# EAGLE design untitled (EAGLE 9.6.2)
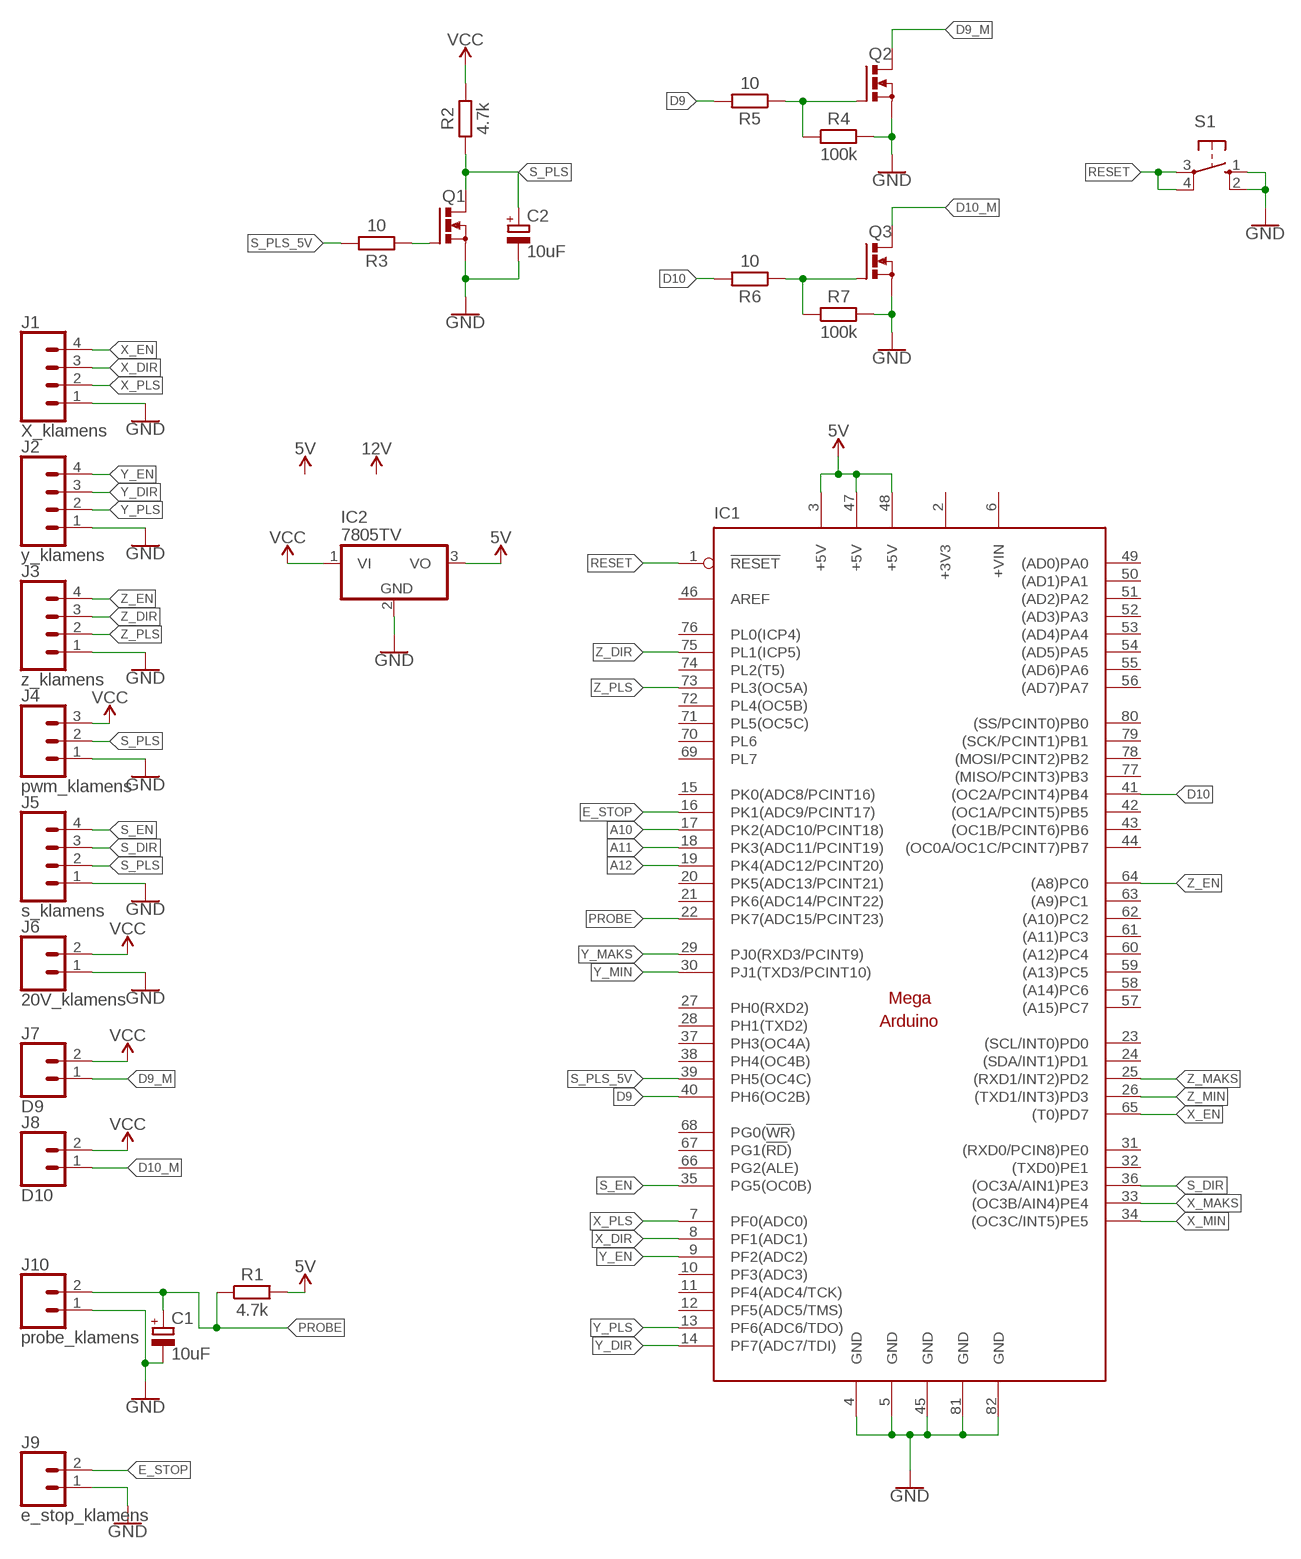
[diagram p0: schematic, sheet 1]

## Parts
C1  10uF  C-POL_RADIAL-11MM-DIA  [CAPPRD508W65D1000H1100B]
C2  10uF  C-POL_RADIAL-11MM-DIA  [CAPPRD508W65D1000H1100B]
IC1  MEGAARDUINO_1  [MEGA_ARDUINO]
IC2  7805TV  [TO220V]
J1  X_klamens  CONN_04SCREW_LOCK  [SCREWTERMINAL-3.5MM-4_LOCK]
J2  y_klamens  CONN_04SCREW_LOCK  [SCREWTERMINAL-3.5MM-4_LOCK]
J3  z_klamens  CONN_04SCREW_LOCK  [SCREWTERMINAL-3.5MM-4_LOCK]
J4  pwm_klamens  CONN_03SCREW  [SCREWTERMINAL-3.5MM-3]
J5  s_klamens  CONN_04SCREW_LOCK  [SCREWTERMINAL-3.5MM-4_LOCK]
J6  20V_klamens  CONN_023.5MM_LOCK  [SCREWTERMINAL-3.5MM-2_LOCK]
J7  D9  CONN_023.5MM_LOCK  [SCREWTERMINAL-3.5MM-2_LOCK]
J8  D10  CONN_023.5MM_LOCK  [SCREWTERMINAL-3.5MM-2_LOCK]
J9  e_stop_klamens  CONN_023.5MM_LOCK  [SCREWTERMINAL-3.5MM-2_LOCK]
J10  probe_klamens  CONN_023.5MM_LOCK  [SCREWTERMINAL-3.5MM-2_LOCK]
Q1  PMOSFET_NTO220BV  [TO220BV]
Q2  PMOSFET_NTO220BV  [TO220BV]
Q3  PMOSFET_NTO220BV  [TO220BV]
R1  4.7k  R_AXIAL-11.7MM-PITCH  [RESAD1176W63L850D250B]
R2  4.7k  R_AXIAL-11.7MM-PITCH  [RESAD1176W63L850D250B]
R3  10  R_AXIAL-11.7MM-PITCH  [RESAD1176W63L850D250B]
R4  100k  R_AXIAL-11.7MM-PITCH  [RESAD1176W63L850D250B]
R5  10  R_AXIAL-11.7MM-PITCH  [RESAD1176W63L850D250B]
R6  10  R_AXIAL-11.7MM-PITCH  [RESAD1176W63L850D250B]
R7  100k  R_AXIAL-11.7MM-PITCH  [RESAD1176W63L850D250B]
S1  10-XX  [B3F-10XX]

## Nets
5V: IC1.3(+5V) IC1.47(+5V) IC1.48(+5V) IC2.3(VO) R1.2
A10: IC1.17(PK2(ADC10/PCINT18))
A11: IC1.18(PK3(ADC11/PCINT19))
A12: IC1.19(PK4(ADC12/PCINT20))
D9: IC1.40(PH6(OC2B)) R5.2
D9_M: J7.1 Q2.D
D10: IC1.41((OC2A/PCINT4)PB4) R6.2
D10_M: J8.1 Q3.D
E_STOP: IC1.16(PK1(ADC9/PCINT17)) J9.2
GND: C1.2(-) C2.2(-) IC1.4(GND) IC1.5(GND) IC1.45(GND) IC1.81(GND) IC1.82(GND) IC2.2(GND) J1.1 J2.1 J3.1 J4.1 J5.1 J6.1 J9.1 J10.1 Q1.S Q2.S Q3.S R4.2 R7.2 S1.1(S) S1.2(S1)
N$1: Q2.G R4.1 R5.1
N$2: Q1.G R3.1
N$3: Q3.G R6.1 R7.1
PROBE: C1.1(+) IC1.22(PK7(ADC15/PCINT23)) J10.2 R1.1
RESET: IC1.1(!RESET) S1.3(P) S1.4(P1)
S_DIR: IC1.36((OC3A/AIN1)PE3) J5.3
S_EN: IC1.35(PG5(OC0B)) J5.4
S_PLS: C2.1(+) J4.2 J5.2 Q1.D R2.1
S_PLS_5V: IC1.39(PH5(OC4C)) R3.2
VCC: IC2.1(VI) J4.3 J6.2 J7.2 J8.2 R2.2
X_DIR: IC1.8(PF1(ADC1)) J1.3
X_EN: IC1.65((T0)PD7) J1.4
X_MAKS: IC1.33((OC3B/AIN4)PE4)
X_MIN: IC1.34((OC3C/INT5)PE5)
X_PLS: IC1.7(PF0(ADC0)) J1.2
Y_DIR: IC1.14(PF7(ADC7/TDI)) J2.3
Y_EN: IC1.9(PF2(ADC2)) J2.4
Y_MAKS: IC1.29(PJ0(RXD3/PCINT9))
Y_MIN: IC1.30(PJ1(TXD3/PCINT10))
Y_PLS: IC1.13(PF6(ADC6/TDO)) J2.2
Z_DIR: IC1.75(PL1(ICP5)) J3.3
Z_EN: IC1.64((A8)PC0) J3.4
Z_MAKS: IC1.25((RXD1/INT2)PD2)
Z_MIN: IC1.26((TXD1/INT3)PD3)
Z_PLS: IC1.73(PL3(OC5A)) J3.2
Unconnected: IC1.10(PF3(ADC3)) IC1.11(PF4(ADC4/TCK)) IC1.12(PF5(ADC5/TMS)) IC1.15(PK0(ADC8/PCINT16)) IC1.20(PK5(ADC13/PCINT21)) IC1.21(PK6(ADC14/PCINT22)) IC1.23((SCL/INT0)PD0) IC1.24((SDA/INT1)PD1) IC1.27(PH0(RXD2)) IC1.28(PH1(TXD2)) IC1.31((RXD0/PCIN8)PE0) IC1.32((TXD0)PE1) IC1.37(PH3(OC4A)) IC1.38(PH4(OC4B)) IC1.42((OC1A/PCINT5)PB5) IC1.43((OC1B/PCINT6)PB6) IC1.44((OC0A/OC1C/PCINT7)PB7) IC1.46(AREF) IC1.49((AD0)PA0) IC1.50((AD1)PA1) IC1.51((AD2)PA2) IC1.52((AD3)PA3) IC1.53((AD4)PA4) IC1.54((AD5)PA5) IC1.55((AD6)PA6) IC1.56((AD7)PA7) IC1.57((A15)PC7) IC1.58((A14)PC6) IC1.59((A13)PC5) IC1.60((A12)PC4) IC1.61((A11)PC3) IC1.62((A10)PC2) IC1.63((A9)PC1) IC1.66(PG2(ALE)) IC1.67(PG1(!RD!)) IC1.68(PG0(!WR!)) IC1.69(PL7) IC1.70(PL6) IC1.71(PL5(OC5C)) IC1.72(PL4(OC5B)) IC1.74(PL2(T5)) IC1.76(PL0(ICP4)) IC1.77((MISO/PCINT3)PB3) IC1.78((MOSI/PCINT2)PB2) IC1.79((SCK/PCINT1)PB1) IC1.80((SS/PCINT0)PB0)

## Power pins joined to a net without a drawn wire
+3V3: IC1.2(+3V3)
+VIN: IC1.6(+VIN)

## Library data of the parts
C1 C2 = Capacitor:C-POL: Capacitor Polarised - Generic; CATEGORY: Capacitor
IC1 = arduino:MEGAARDUINO_1: The Arduino Mega is a microcontroller board based on the ATmega1280. - 54 digital input/output pins (of which 14 can be used as PWM outputs) - 16 analog inputs - 4 UARTs (hardware serial ports) - 16 MHz crystal oscillator - USB connection - power jack - ICSP header - reset button It contains everything needed to support the microcontroller; simply connect it to a computer with a USB cable or power it with a AC-to-DC adapter or battery to get started. The Mega is compatible with most shields designed for the Arduino Duemilanove or Diecimila. http://arduino.cc/en/Main/ArduinoBoardMega
IC2 = linear:78*: Positive VOLTAGE REGULATOR Source: http://cache.national.com/ds/LM/LM78L05.pdf http://www.fairchildsemi.com/ds/LM/LM7805.pdf
J1-J3 J5 = SparkFun-Connectors:CONN_04: Multi connection point. Often used as Generic Header-pin footprint for 0.1 inch spaced/style header connections On any of the 0.1 inch spaced packages, you can populate with these: Break Away Headers - Straight <https://www.sparkfun.com/products/116> (PRT-00116) Break Away Male Headers - Right Angle <https://www.sparkfun.com/products/553> (PRT-00553) Female Headers <https://www.sparkfun.com/products/115> (PRT-00115) Break Away Headers - Machine Pin <https://www.sparkfun.com/products/117> (PRT-00117) Break Away Female Headers - Swiss Machine Pin <https://www.sparkfun.com/products/743> (PRT-00743) For SCREWTERMINALS and SPRING TERMINALS visit here: Screw Terimnals on SparkFun.com <https://www.sparkfun.com/search/results?term=Screw+Terminals> (5mm/3.5mm/2.54mm spacing) This device is also useful as a general connection point to wire up your design to another part of your project. Our various solder wires solder well into these plated through hole pads. Hook-Up Wire - Assortment (Stranded, 22 AWG) <https://www.sparkfun.com/products/11375> (PRT-11375) Hook-Up Wire - Assortment (Solid Core, 22 AWG) <https://www.sparkfun.com/products/11367> (PRT-11367) View the entire wire category on our website here <https://www.sparkfun.com/categories/141> Special notes: Molex polarized connector foot print use with SKU : PRT-08231 with associated crimp pins and housings. 1MM SMD Version SKU: PRT-10208
J4 = SparkFun-Connectors:CONN_03: Multi connection point. Often used as Generic Header-pin footprint for 0.1 inch spaced/style header connections On any of the 0.1 inch spaced packages, you can populate with these: Break Away Headers - Straight <https://www.sparkfun.com/products/116> (PRT-00116) Break Away Male Headers - Right Angle <https://www.sparkfun.com/products/553> (PRT-00553) Female Headers <https://www.sparkfun.com/products/115> (PRT-00115) Break Away Headers - Machine Pin <https://www.sparkfun.com/products/117> (PRT-00117) Break Away Female Headers - Swiss Machine Pin <https://www.sparkfun.com/products/743> (PRT-00743) Stackable Header - 3 Pin (Female, 0.1") <https://www.sparkfun.com/products/13875> (PRT-13875) For SCREWTERMINALS and SPRING TERMINALS visit here: Screw Terimnals on SparkFun.com <https://www.sparkfun.com/search/results?term=Screw+Terminals> (5mm/3.5mm/2.54mm spacing) This device is also useful as a general connection point to wire up your design to another part of your project. Our various solder wires solder well into these plated through hole pads. Hook-Up Wire - Assortment (Stranded, 22 AWG) <https://www.sparkfun.com/products/11375> (PRT-11375) Hook-Up Wire - Assortment (Solid Core, 22 AWG) <https://www.sparkfun.com/products/11367> (PRT-11367) View the entire wire category on our website here <https://www.sparkfun.com/categories/141> Special notes: Molex polarized connector foot print use with SKU : PRT-08232 with associated crimp pins and housings.; PROD_ID: CONN-08288; SF_ID: PRT-08235
J6-J10 = SparkFun-Connectors:CONN_02: Multi connection point. Often used as Generic Header-pin footprint for 0.1 inch spaced/style header connections On any of the 0.1 inch spaced packages, you can populate with these: Break Away Headers - Straight <https://www.sparkfun.com/products/116> (PRT-00116) Break Away Male Headers - Right Angle <https://www.sparkfun.com/products/553> (PRT-00553) Female Headers <https://www.sparkfun.com/products/115> (PRT-00115) Break Away Headers - Machine Pin <https://www.sparkfun.com/products/117> (PRT-00117) Break Away Female Headers - Swiss Machine Pin <https://www.sparkfun.com/products/743> (PRT-00743) For SCREWTERMINALS and SPRING TERMINALS visit here: Screw Terimnals on SparkFun.com <https://www.sparkfun.com/search/results?term=Screw+Terminals> (5mm/3.5mm/2.54mm spacing) This device is also useful as a general connection point to wire up your design to another part of your project. Our various solder wires solder well into these plated through hole pads. Hook-Up Wire - Assortment (Stranded, 22 AWG) <https://www.sparkfun.com/products/11375> (PRT-11375) Hook-Up Wire - Assortment (Solid Core, 22 AWG) <https://www.sparkfun.com/products/11367> (PRT-11367) View the entire wire category on our website here <https://www.sparkfun.com/categories/141> Special notes: Molex polarized connector foot print use with: PRT-08233 with associated crimp pins and housings. 2.54_SCREWTERM for use with PRT-10571. 3.5mm Screw Terminal footprints for PRT-08084 5mm Screw Terminal footprints for use with PRT-08432; PROD_ID: CONN-08399
Q1-Q3 = transistor-power:PMOSFET_N: Power MOSFET N-Channel
R1-R7 = Resistor:R: Resistor Fixed - Generic; CATEGORY: Resistor; SUB-CATEGORY: Fixed
S1 = switch-omron:10-XX: OMRON SWITCH; MPN: B3F-1000; OC_FARNELL: 176432; OC_NEWARK: 36M3542

## Board
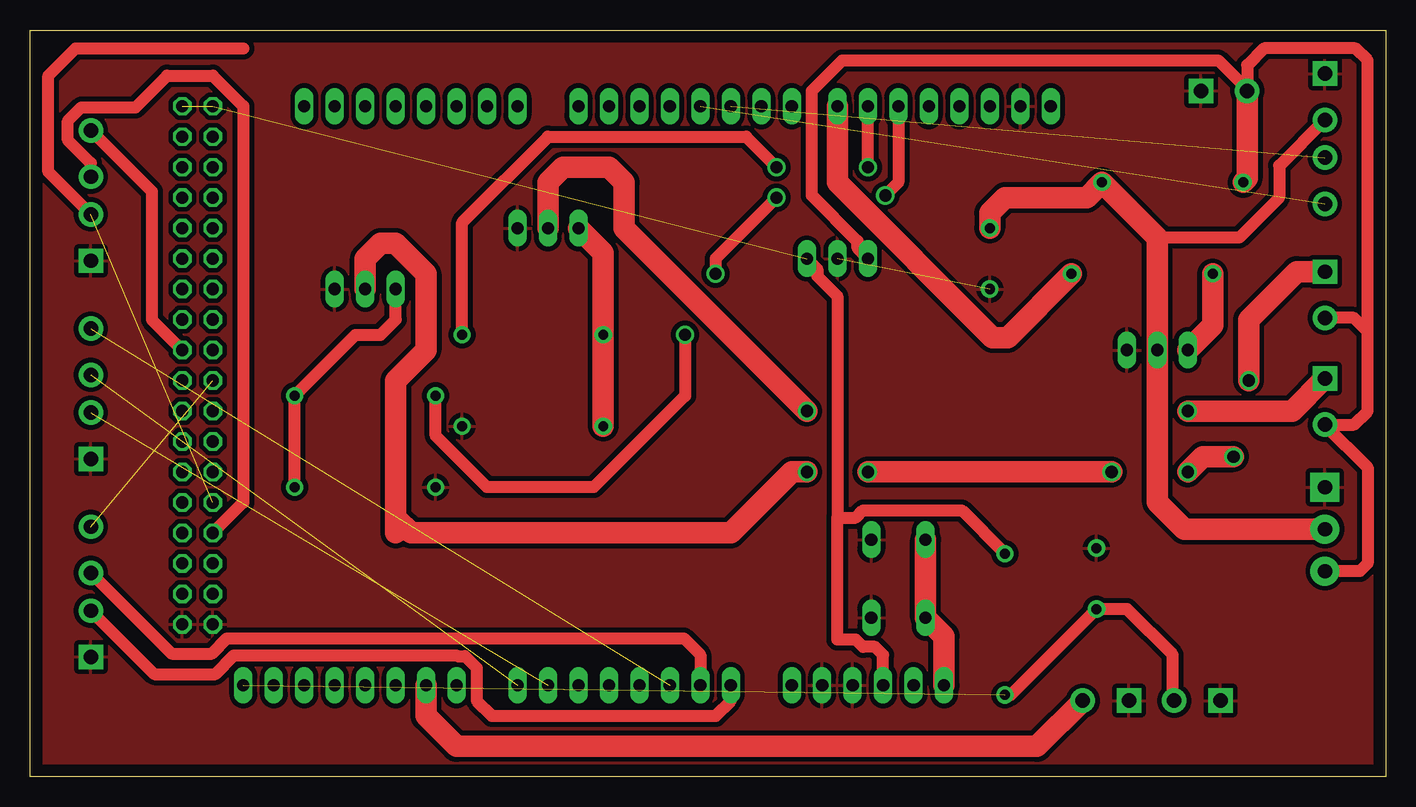
[diagram p1: board, top side]
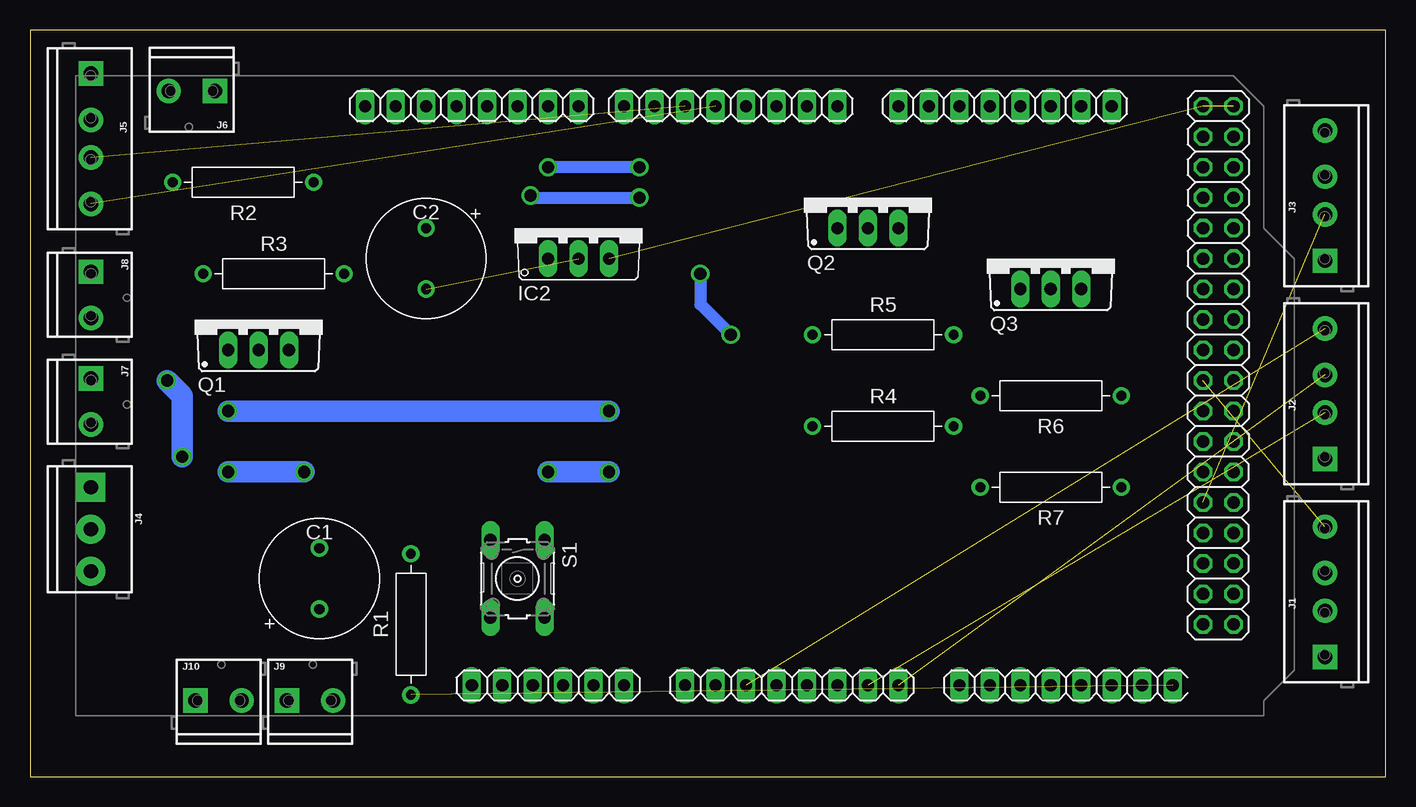
[diagram p2: board, bottom side, seen from below]

Size 113.03 x 62.23 mm. Coordinates in mm from the lower left corner, seen from the top.
Outline: 113.03,0 0.02,0 0,62.23 113.03,62.23 113.03,0
Copper layers (1*16): Top 0.035mm / dielectric 1.5mm / Bottom 0.035mm
Design rules "cnc_0.4_eagle_ayarlar": minimum track width 6mil, minimum drill 0.35mm, track to track 0.4mm, track to pad 0.4mm, pad to pad 0.4mm, via to via 0.4mm, smd to smd 0.4mm, copper to edge 40mil, drill to drill 0.4mm, minimum pad ring 10mil, minimum via ring 8mil, stop-mask expansion 4mil, vias tented up to drill 0mil, thermal gap 0.4mm

### Footprints (pad centres in the part's own frame; a part is rotated, then mirrored left to right if it is on the bottom)
CAPPRD508W65D1000H1100B = drill 0.85 pad 1.45: 1 -2.54,0; 2 2.54,0
MEGA_ARDUINO = drill 1.016 long: 1 33.02,2.54; 2 35.56,2.54; 3 38.1,2.54; 4 40.64,2.54; 5 43.18,2.54; 6 45.72,2.54; 7 50.8,2.54; 8 53.34,2.54; 9 55.88,2.54; 10 58.42,2.54; 11 60.96,2.54; 12 63.5,2.54; 13 66.04,2.54; 14 68.58,2.54; 15 73.66,2.54; 16 76.2,2.54; 17 78.74,2.54; 18 81.28,2.54; 19 83.82,2.54; 20 86.36,2.54; 21 88.9,2.54; 22 91.44,2.54; 23 86.36,50.8; 24 83.82,50.8; 25 81.28,50.8; 26 78.74,50.8; 27 76.2,50.8; 28 73.66,50.8; 29 71.12,50.8; 30 68.58,50.8; 31 63.5,50.8; 32 60.96,50.8; 33 58.42,50.8; 34 55.88,50.8; 35 53.34,50.8; 36 50.8,50.8; 37 48.26,50.8; 38 45.72,50.8; 39 41.91,50.8; 40 39.37,50.8; 41 36.83,50.8; 42 34.29,50.8; 43 31.75,50.8; 44 29.21,50.8; 45 26.67,50.8; 46 24.13,50.8 | drill 1.016 octagon: 47 93.98,50.8; 48 96.52,50.8; 49 93.98,48.26; 50 96.52,48.26; 51 93.98,45.72; 52 96.52,45.72; 53 93.98,43.18; 54 96.52,43.18; 55 93.98,40.64; 56 96.52,40.64; 57 93.98,38.1; 58 96.52,38.1; 59 93.98,35.56; 60 96.52,35.56; 61 93.98,33.02; 62 96.52,33.02; 63 93.98,30.48; 64 96.52,30.48; 65 93.98,27.94; 66 96.52,27.94; 67 93.98,25.4; 68 96.52,25.4; 69 93.98,22.86; 70 96.52,22.86; 71 93.98,20.32; 72 96.52,20.32; 73 93.98,17.78; 74 96.52,17.78; 75 93.98,15.24; 76 96.52,15.24; 77 93.98,12.7; 78 96.52,12.7; 79 93.98,10.16; 80 96.52,10.16; 81 93.98,7.62; 82 96.52,7.62
TO220V = drill 1.016 long: 1 -2.54,-2.54; 2 0,-2.54; 3 2.54,-2.54
SCREWTERMINAL-3.5MM-4_LOCK = drill 1.2 pad 2.032 square: 1 -0.178,0 | drill 1.2 pad 2.032: 2 3.678,0; 3 6.822,0; 4 10.678,0
SCREWTERMINAL-3.5MM-3 = drill 1.2 pad 2.413 square: 1 0,0 | drill 1.2 pad 2.413: 2 3.5,0; 3 7,0
SCREWTERMINAL-3.5MM-2_LOCK = drill 1.2 pad 2.032 square: 1 -0.178,0 | drill 1.2 pad 2.032: 2 3.678,0
TO220BV = drill 1.016 long: D 0,-2.54; G -2.54,-2.54; S 2.54,-2.54
RESAD1176W63L850D250B = drill 0.83 pad 1.43: 1 -5.88,0; 2 5.88,0
B3F-10XX = drill 1.016 long: 1 -3.251,2.261; 2 3.251,2.261; 3 -3.251,-2.261; 4 3.251,-2.261

### Placement (x,y rotation side)
C1  88.9,16.51 90 bottom
C2  80.01,43.18 270 bottom
IC1  109.22,5.08 0 bottom
IC2  67.31,45.72 0 bottom
J1  5.08,10.16 90 bottom
J2  5.08,26.67 90 bottom
J3  5.08,43.18 90 bottom
J4  107.95,24.13 270 bottom
J5  107.95,58.42 270 bottom
J6  97.79,57.15 180 bottom
J7  107.95,33.02 270 bottom
J8  107.95,41.91 270 bottom
J9  91.44,6.35 0 bottom
J10  99.06,6.35 0 bottom
Q1  93.98,38.1 0 bottom
Q2  43.18,48.26 0 bottom
Q3  27.94,43.18 0 bottom
R1  81.28,12.7 90 bottom
R2  95.25,49.53 180 bottom
R3  92.71,41.91 0 bottom
R4  41.91,29.21 0 bottom
R5  41.91,36.83 0 bottom
R6  27.94,31.75 180 bottom
R7  27.94,24.13 180 bottom
S1  72.39,16.51 270 bottom

### Tracks (layer width: path | path; a pad name or v marks a point on that pad's centre or on a via)
5V  (2 unrouted)
  Top 1.016: IC1.3 71.12,10.16 70.45,10.83 69.44,10.83 68.83,11.43 67.31,11.43 67.31,21.59 | 67.31,21.59 68.83,21.59 69.44,22.19 77.67,22.19 R1.2 | IC2.3 65.64,42.31 65.64,41.73 67.31,40.06 67.31,21.59
D9  (via drill 1.02)
  Top 1.016: R5.2 36.03,46.19 43.18,53.34 59.69,53.34 v62.23,50.8 | v69.85,50.8 IC1.40
  Bottom 1.016: v62.23,50.8 v69.85,50.8
D9_M  (via drill 1.02)
  Top 1.778: J7.1 105.23,30.48 v96.52,30.48 | v64.77,30.48 49.53,45.72 49.53,49.53 48.26,50.8 44.45,50.8 43.18,49.53 Q2.D
  Bottom 1.778: v96.52,30.48 v64.77,30.48
D10  (via drill 1.02)
  Top 1.016: IC1.41 72.39,49.53 v71.3,48.44 | v62.23,48.26 57.15,43.18 v57.15,41.91 | v54.61,36.83 54.61,31.75 46.99,24.13 38.1,24.13 33.82,28.41 R6.2
  Bottom 1.016: v71.3,48.44 71.12,48.26 v62.23,48.26 | v57.15,41.91 57.15,39.37 v54.61,36.83
D10_M  (via drill 1.02)
  Top 1.778: Q3.D 27.94,43.18 29.21,44.45 30.48,44.45 33.02,41.91 33.02,35.56 30.48,33.02 30.48,21.59 | 30.48,21.59 30.48,20.32 | 30.48,21.59 31.75,20.32 58.42,20.32 63.5,25.4 v64.77,25.4 | v69.85,25.4 v90.17,25.4 | v96.52,25.4 97.79,26.67 v100.33,26.67 | v101.6,33.02 101.6,38.1 105.59,42.09 J8.1
  Bottom 1.778: v64.77,25.4 v69.85,25.4 | v90.17,25.4 v96.52,25.4 | v100.33,26.67 100.33,31.75 v101.6,33.02
E_STOP
  Top 1.778: J9.2 83.95,2.54 35.56,2.54 33.02,5.08 IC1.16
GND  (1 unrouted)
  pour Top: 114.3,63.5 114.3,-1.27 -1.27,-1.27 -1.27,63.5
N$1
  Top 1.778: Q2.G 47.79,43.65 R5.1 R4.1
N$2
  Top 1.778: Q1.G 98.59,37.63 R3.1
N$3
  Top 1.016: Q3.G 30.48,38.1 29.21,36.83 27.14,36.83 R6.1 R7.1
PROBE  (1 unrouted)
  Top 1.016: J10.2 95.25,6.48 95.25,10.16 91.44,13.97 C1.1 81.75,6.82 R1.1
RESET
  Top 1.778: IC1.1 76.2,11.71 S1.4 S1.3
S_DIR  (1 unrouted)
S_EN  (1 unrouted)
S_PLS
  Top 1.016: J5.2 104.14,50.93 104.14,48.26 100.8,44.92 93.98,44.92
  Top 1.778: C2.1 80.01,46.99 81.28,48.26 88.1,48.26 R2.1 93.98,44.92 Q1.D 93.98,22.86 96.21,20.63 J4.2
S_PLS_5V
  Top 1.778: IC1.39 67.31,49.53 80.25,36.6 81.52,36.6 R3.2
VCC
  Top 1.016: J4.3 110.86,17.13 111.51,17.78 111.51,25.79 J7.2 110.37,29.34 111.51,30.48 111.51,37.08 | J8.2 110.36,38.23 111.51,37.08 | 111.51,37.08 111.51,59.69 110.49,60.71 102.87,60.71 101.47,59.3 J6.2 101.47,57.28 99.06,59.69 67.71,59.69 65.17,57.15 65.17,48.44 68.98,44.63 68.98,44.05 IC2.1
  Top 1.778: J6.2 101.47,49.87 R2.2
X_DIR
  Top 1.016: J1.3 11.79,10.27 15.18,10.27 16.43,11.53 54.52,11.53 55.88,10.16 IC1.8
X_EN  (1 unrouted)
X_PLS
  Top 1.016: J1.2 10.36,8.56 15.47,8.56 17.02,10.11 35.56,10.11 35.62,10.05 36.25,10.05 37.23,9.07 37.23,6.35 38.5,5.08 57.15,5.08 58.42,6.35 IC1.7
Y_DIR  (1 unrouted)
Y_EN  (1 unrouted)
Y_PLS  (1 unrouted)
Z_DIR
  Top 1.016: J3.3 5.08,51.14 3.16,53.06 3.16,54.66 4.28,55.78 8.79,55.78 11.43,58.42 15.24,58.42 17.78,55.88 17.78,22.86 IC1.75
Z_EN
  Top 1.016: J3.4 10.16,48.78 10.16,38.1 IC1.64
Z_PLS  (1 unrouted)
  Top 1.016: J3.2 1.53,50.41 1.52,58.42 3.81,60.71 17.78,60.71